# EAGLE design geiger (EAGLE 7.1.0)
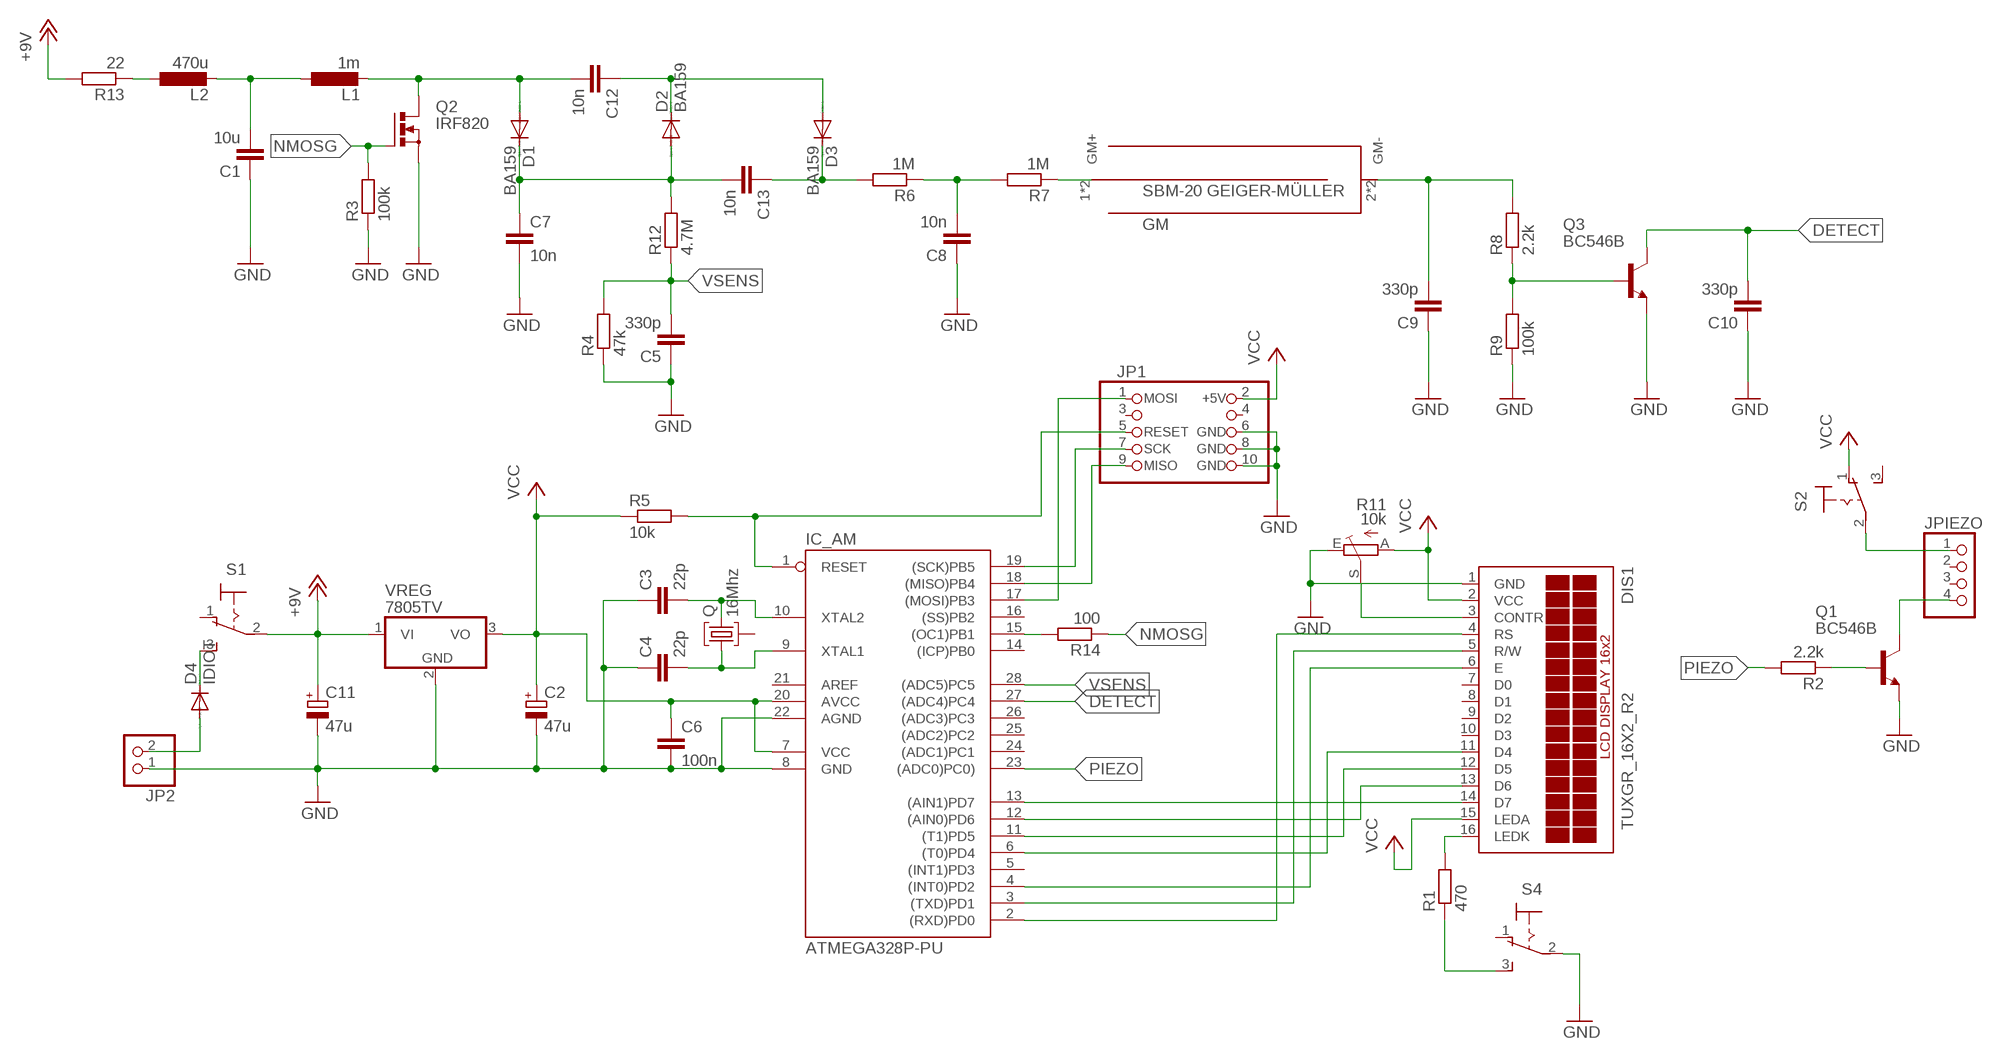
[diagram p0: schematic, sheet 1]

## Parts
C1  10u  C-EUC1206  [C1206]
C2  47u  CPOL-EUE2.5-6  [E2,5-6]
C3  22p  C-EUC0805  [C0805]
C4  22p  C-EUC0805  [C0805]
C5  330p  C-EU025-025X050  [C025-025X050]
C6  100n  C-EUC0805  [C0805]
C7  10n  C-EU050-025X075  [C050-025X075]
C8  10n  C-EU050-025X075  [C050-025X075]
C9  330p  C-EU025-025X050  [C025-025X050]
C10  330p  C-EU025-025X050  [C025-025X050]
C11  47u  CPOL-EUE2.5-6  [E2,5-6]
C12  10n  C-EU050-025X075  [C050-025X075]
C13  10n  C-EU050-025X075  [C050-025X075]
D1  BA159  DIODE-DO41-7.6  [DO41-7.6]
D2  BA159  DIODE-DO41-7.6  [DO41-7.6]
D3  BA159  DIODE-DO41-7.6  [DO41-7.6]
D4  IDIOT  DIODE-DO41-7.6  [DO41-7.6]
DIS1  TUXGR_16X2_R2  [TUXGR_16X2_R2]
GM  SBM-20  [SBM-20]
IC_AM  ATMEGA328P-PU  [DIL28-3]
JP1  ISP10-M  [2X05]
JP2  PINHD-1X2  [1X02]
JPIEZO  PINHD-1X4  [1X04]
L1  1m  L-EU6000-XXX-RC  [6000-XXXX-RC]
L2  470u  L-EU2200-12.7  [2200-12.7]
Q  16Mhz  10M15AHC49T  [HC49U]
Q1  BC546B  [TO92-EBC]
Q2  IRF820  IRF512  [TO220BV]
Q3  BC546B  [TO92-EBC]
R1  470  R-EU_0204/7  [0204/7]
R2  2.2k  R-EU_0204/7  [0204/7]
R3  100k  R-EU_0204/7  [0204/7]
R4  47k  R-EU_0204/7  [0204/7]
R5  10k  R-EU_0204/7  [0204/7]
R6  1M  R-EU_0204/7  [0204/7]
R7  1M  R-EU_0204/7  [0204/7]
R8  2.2k  R-EU_0204/7  [0204/7]
R9  100k  R-EU_0204/7  [0204/7]
R11  10k  TRIM_EU-CA6V  [CA6V]
R12  4.7M  R-EU_0204/7  [0204/7]
R13  22  R-EU_0204/7  [0204/7]
R14  100  R-EU_R0805  [R0805]
S1  320-916  [320-916]
S2  320-916  [320-916]
S4  320-916  [320-916]
VREG  7805TV  [TO220V]

## Nets
+9V: C11.+ R13.2 S1.2(P) VREG.1(VI)
DETECT: C10.2 IC_AM.27((ADC4)PC4) Q3.C
GND: C1.1 C2.- C3.1 C4.1 C5.1 C6.2 C7.2 C8.1 C9.1 C10.1 C11.- DIS1.1(GND) IC_AM.8(GND) IC_AM.22(AGND) JP1.6 JP1.8 JP1.10 JP2.1 Q1.E Q2.S Q3.E R3.1 R4.1 R9.1 R11.E S4.2(P) VREG.2(GND)
MISO: IC_AM.18((MISO)PB4) JP1.9
MOSI: IC_AM.17((MOSI)PB3) JP1.1
N$1: DIS1.14(D7) IC_AM.13((AIN1)PD7)
N$2: DIS1.13(D6) IC_AM.12((AIN0)PD6)
N$3: DIS1.12(D5) IC_AM.11((T1)PD5)
N$4: DIS1.11(D4) IC_AM.6((T0)PD4)
N$5: DIS1.3(CONTR) R11.S
N$6: DIS1.6(E) IC_AM.4((INT0)PD2)
N$7: DIS1.5(R/W) IC_AM.3((TXD)PD1)
N$8: DIS1.4(RS) IC_AM.2((RXD)PD0)
N$9: C7.1 C13.2 D1.C D2.A R12.2
N$10: DIS1.16(LEDK) R1.2
N$11: JPIEZO.4 Q1.C
N$12: Q1.B R2.1
N$14: C8.2 R6.1 R7.2
N$15: C9.2 GM.2(GM-) GM.4(GM-) R8.2
N$16: GM.1(GM+) GM.3(GM+) R7.1
N$17: D4.A JP2.2
N$18: Q3.B R8.1 R9.2
N$19: JPIEZO.1 S2.2(P)
N$20: R1.1 S4.3(S)
N$21: C12.1 D2.C D3.A
N$23: C1.2 L1.1 L2.2
N$24: L2.1 R13.1
N$25: IC_AM.15((OC1)PB1) R14.2
N$27: C12.2 D1.A L1.2 Q2.D
N$28: C13.1 D3.C R6.2
N$29: D4.C S1.3(S)
NMOSG: Q2.G R3.2 R14.1
PIEZO: IC_AM.23((ADC0)PC0)) R2.2
RESET: IC_AM.1(RESET) JP1.5 R5.2
SCK: IC_AM.19((SCK)PB5) JP1.7
VCC: C2.+ C6.1 DIS1.2(VCC) DIS1.15(LEDA) IC_AM.7(VCC) IC_AM.20(AVCC) JP1.2 R5.1 R11.A S2.1(O) VREG.3(VO)
VSENS: C5.2 IC_AM.28((ADC5)PC5) R4.2 R12.1
XTAL1: C4.2 IC_AM.9(XTAL1) Q.1
XTAL2: C3.2 IC_AM.10(XTAL2) Q.3
Unconnected: DIS1.7(D0) DIS1.8(D1) DIS1.9(D2) DIS1.10(D3) IC_AM.5((INT1)PD3) IC_AM.14((ICP)PB0) IC_AM.16((SS)PB2) IC_AM.21(AREF) IC_AM.24((ADC1)PC1) IC_AM.25((ADC2)PC2) IC_AM.26((ADC3)PC3) JP1.3 JP1.4 JPIEZO.2 JPIEZO.3 Q.2 S1.1(O) S2.3(S) S4.1(O)

## Library data of the parts
C1 C3-C10 C12 C13 = rcl:C-EU: CAPACITOR, European symbol
C2 C11 = rcl:CPOL-EU: POLARIZED CAPACITOR, European symbol
D1-D4 = diode:DIODE-: DIODE
DIS1 = display-lcd:TUXGR_16X2_R2: Tuxgraphics LCD display 16x2 characters reflective, without background light Source: tuxgr_12x2_r2.pdf; OC_FARNELL: unknown; OC_NEWARK: unknown
GM = own-lib:SBM-20: Russian SBM-20 Geiger Müller Tube
IC_AM = arduino_Uno_Rev3-02-TH:ATMEGA328P-: MICROCONTROLLER 4 Kbytes FLASH 128 bytes SRAM 256 bytes EEPROM UART 6-channel 10 bit ADC
JP1 = own-lib:ISP10-M: PIN HEADER
JP2 = pinhead:PINHD-1X2: PIN HEADER
JPIEZO = pinhead:PINHD-1X4: PIN HEADER
L1 L2 = rcl:L-EU: INDUCTOR, European symbol
Q = crystal:10M*A: Monolithic Crystal Filters Source: www.vanlong.com; OC_FARNELL: unknown; OC_NEWARK: unknown
Q1 Q3 = transistor-npn:BC546*: NPN Transistor
Q2 = transistor-power:IRF512: N-CHANNEL MOS FET
R1-R9 R12-R14 = rcl:R-EU_: RESISTOR, European symbol
R11 = pot:TRIM_EU-: POTENTIOMETER
S1 S2 S4 = switch:320-916: TOGGLE SWITCH distributor RS Components
VREG = linear:78*: Positive VOLTAGE REGULATOR Source: http://cache.national.com/ds/LM/LM78L05.pdf http://www.fairchildsemi.com/ds/LM/LM7805.pdf

## Board
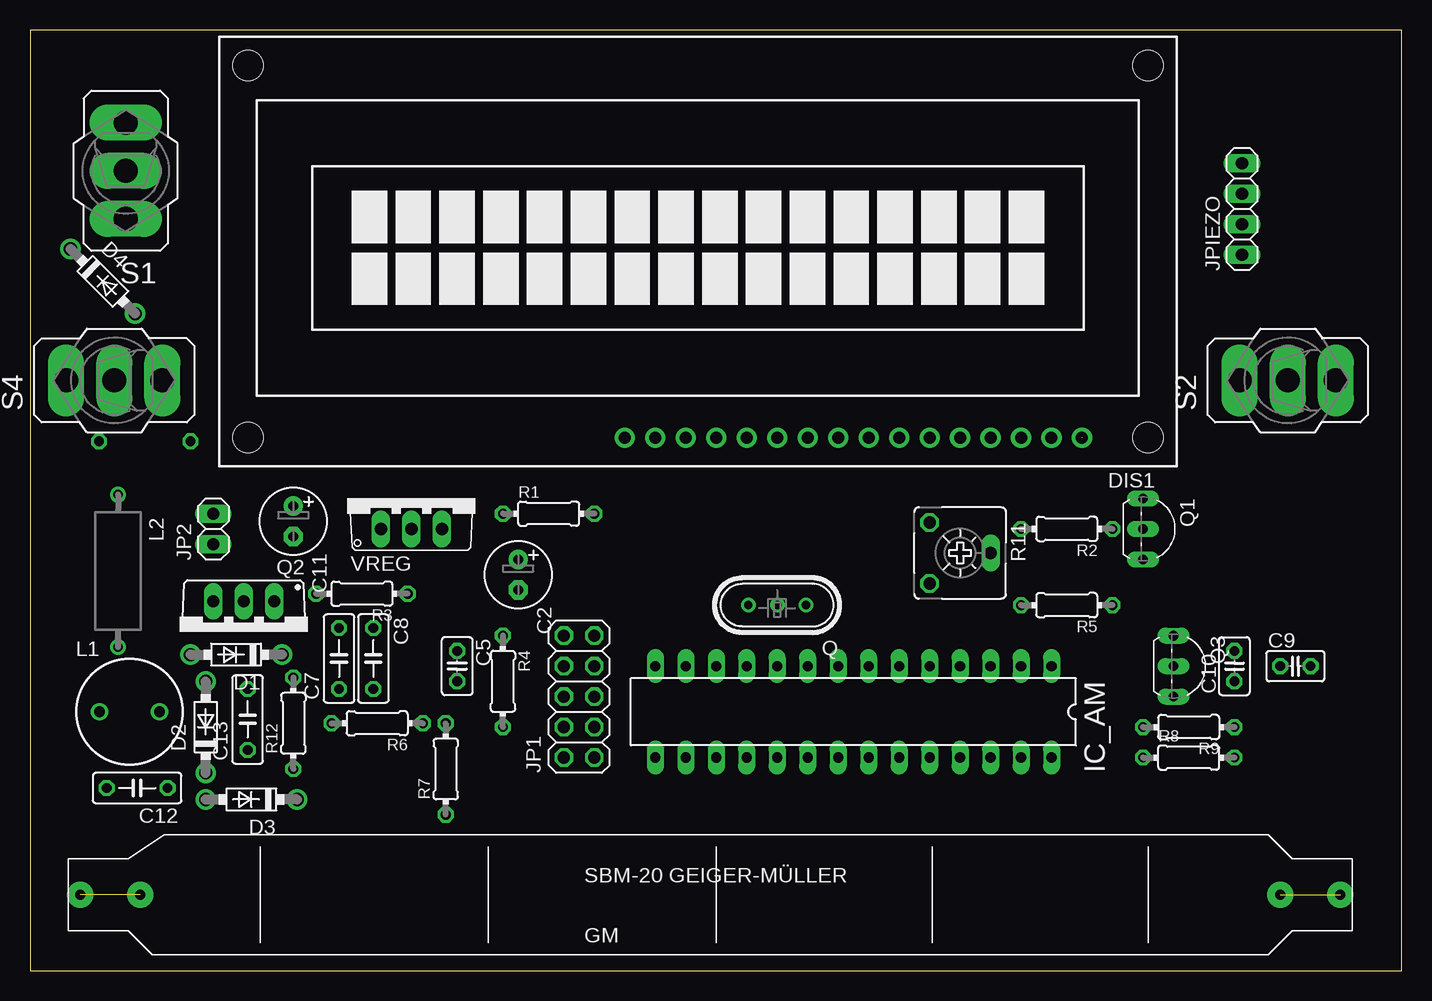
[diagram p1: board, top side]
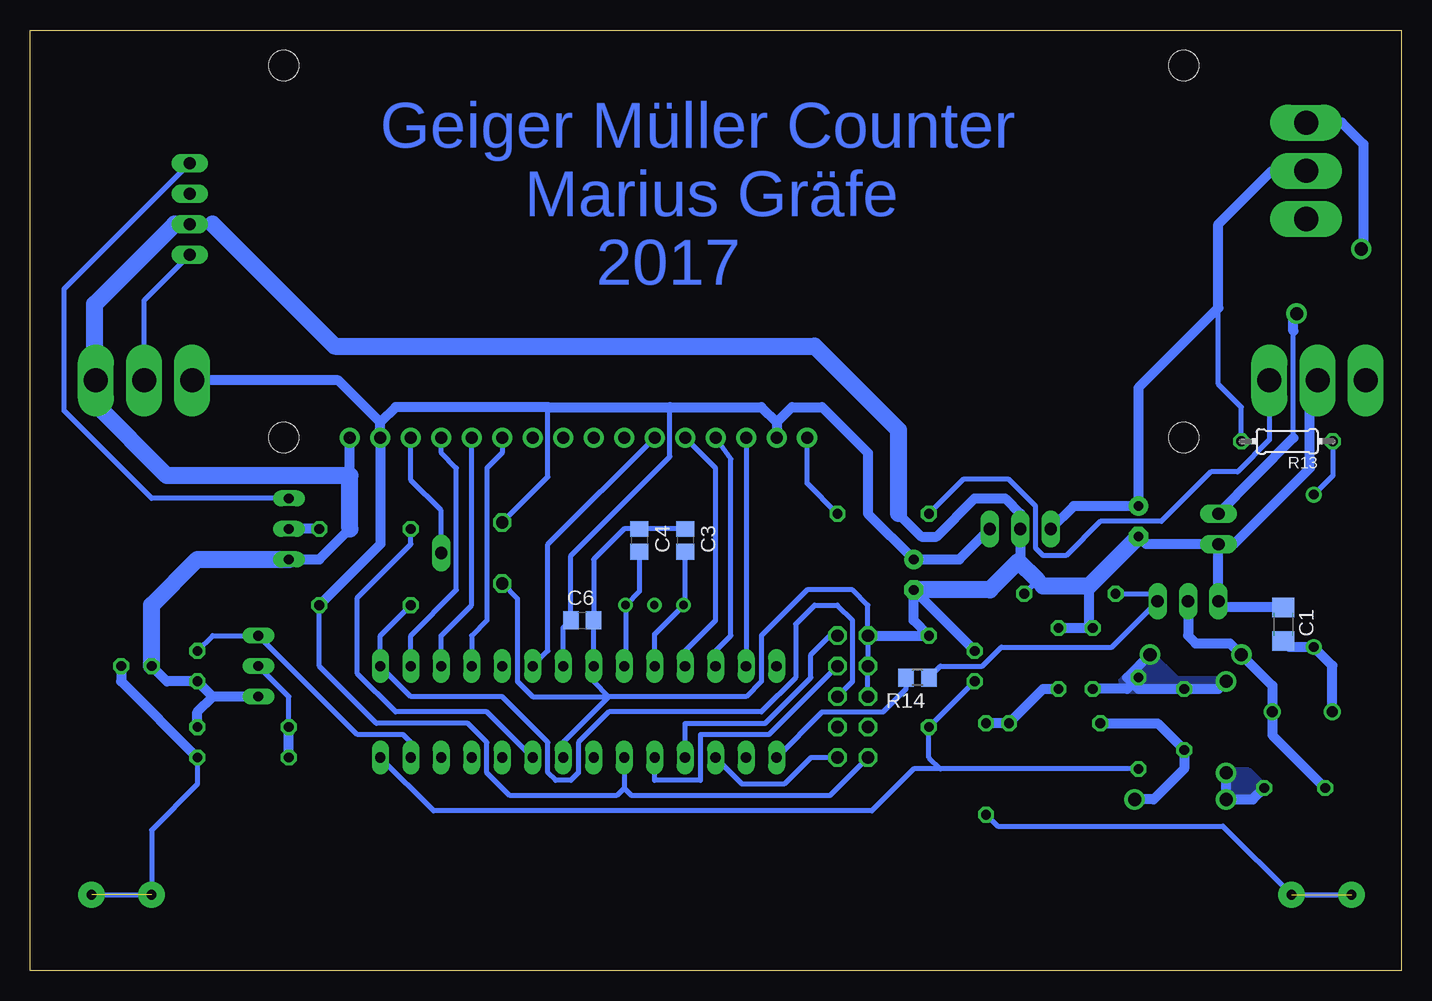
[diagram p2: board, bottom side, seen from below]

Size 114.28 x 78.41 mm. Coordinates in mm from the lower left corner, seen from the top.
Outline: 0,0 114.28,0 114.28,78.41 0,78.41 0,0
Copper layers (1*16): Top 0.035mm / dielectric 1.5mm / Bottom 0.035mm
Design rules "default": minimum track width 10mil, minimum drill 24mil, track to track 8mil, track to pad 8mil, pad to pad 8mil, via to via 8mil, smd to smd 8mil, copper to edge 40mil, drill to drill 8mil, minimum pad ring 10mil, minimum via ring 8mil, stop-mask expansion 4mil, vias tented up to drill 0mil, thermal gap 10mil

### Footprints (pad centres in the part's own frame; a part is rotated, then mirrored left to right if it is on the bottom)
C1206 = smd 1.6 x 1.8: 1 -1.4,0; 2 1.4,0
E2,5-6 = drill 0.813 pad 1.6: + -1.27,0 | drill 0.813 pad 1.6 octagon: - 1.27,0
C0805 = smd 1.3 x 1.5: 1 -0.95,0; 2 0.95,0
C025-025X050 = drill 0.813 octagon: 1 -1.27,0; 2 1.27,0
C050-025X075 = drill 0.813 octagon: 1 -2.54,0; 2 2.54,0
DO41-7.6 = drill 1.1 pad 1.7: A 3.81,0; C -3.81,0
TUXGR_16X2_R2 = drill 1 pad 1.676: 1 -31.746,15.246; 2 -29.206,15.246; 3 -26.666,15.246; 4 -24.126,15.246; 5 -21.586,15.246; 6 -19.046,15.246; 7 -16.506,15.246; 8 -13.966,15.246; 9 -11.426,15.246; 10 -8.886,15.246; 11 -6.346,15.246; 12 -3.806,15.246; 13 -1.266,15.246; 14 1.274,15.246; 15 3.814,15.246; 16 6.354,15.246 | hole 2.5: -37.246,-15.754; 37.754,-15.754; -37.246,15.246; 37.754,15.246
SBM-20 = drill 0.8 pad 2.184: 1 -48,0; 2 47,0; 3 -53,0; 4 52,0
DIL28-3 = drill 0.85 pad 1.422 long: 1 -16.51,-3.81; 2 -13.97,-3.81; 3 -11.43,-3.81; 4 -8.89,-3.81; 5 -6.35,-3.81; 6 -3.81,-3.81; 7 -1.27,-3.81; 8 1.27,-3.81; 9 3.81,-3.81; 10 6.35,-3.81; 11 8.89,-3.81; 12 11.43,-3.81; 13 13.97,-3.81; 14 16.51,-3.81; 15 16.51,3.81; 16 13.97,3.81; 17 11.43,3.81; 18 8.89,3.81; 19 6.35,3.81; 20 3.81,3.81; 21 1.27,3.81; 22 -1.27,3.81; 23 -3.81,3.81; 24 -6.35,3.81; 25 -8.89,3.81; 26 -11.43,3.81; 27 -13.97,3.81; 28 -16.51,3.81
2X05 = drill 1.016 octagon: 1 -5.08,-1.27; 2 -5.08,1.27; 3 -2.54,-1.27; 4 -2.54,1.27; 5 0,-1.27; 6 0,1.27; 7 2.54,-1.27; 8 2.54,1.27; 9 5.08,-1.27; 10 5.08,1.27
1X02 = drill 1.016 long: 1 -1.27,0; 2 1.27,0
1X04 = drill 1.016 long: 1 -3.81,0; 2 -1.27,0; 3 1.27,0; 4 3.81,0
6000-XXXX-RC = drill 0.9 pad 1.422: 1 -2.5,0; 2 2.5,0
2200-12.7 = drill 0.8 pad 1.27: 1 -6.35,0; 2 6.35,0
HC49U = drill 0.7 pad 1.2: 1 -2.413,0; 2 -0.027,0; 3 2.413,0
TO92-EBC = drill 0.813 long: B 0,-1.27; C -2.54,-1.27; E 2.54,-1.27
TO220BV = drill 1.016 long: D 0,-2.54; G -2.54,-2.54; S 2.54,-2.54
0204/7 = drill 0.813 octagon: 1 -3.81,0; 2 3.81,0
CA6V = drill 1.016 octagon: A -2.54,-2.54; E 2.54,-2.54 | drill 1.016 long: S 0,2.54
R0805 = smd 1.3 x 1.5: 1 -0.95,0; 2 0.95,0
320-916 = drill 2.007 long: 1 0,4.013; 2 0,0; 3 0,-4.013
TO220V = drill 1.016 long: 1 -2.54,-2.54; 2 0,-2.54; 3 2.54,-2.54

### Placement (x,y rotation side)
C1  9.84,28.89 270 bottom
C2  40.64,33.02 270 top
C3  59.69,35.88 270 bottom
C4  63.5,35.88 270 bottom
C5  35.56,25.4 270 top
C6  68.26,29.21 0 bottom
C7  25.72,26.04 90 top
C8  28.57,26.04 270 top
C9  105.41,25.4 0 top
C10  100.33,25.4 90 top
C11  21.91,37.47 270 top
C12  8.89,15.24 180 top
C13  18.1,20.96 90 top
D1  17.14,26.35 180 top
D2  14.61,20.32 90 top
D3  18.41,14.29 180 top
D4  6.03,57.47 315 top
DIS1  55.88,59.69 180 top
GM  57.15,6.35 0 top
IC_AM  68.58,21.59 180 top
JP1  45.72,22.86 90 top
JP2  15.24,36.83 90 top
JPIEZO  100.97,63.5 90 top
L1  8.25,21.59 0 top
L2  7.3,33.34 270 top
Q  62.23,30.48 180 top
Q1  93.98,36.83 270 top
Q2  17.78,28.26 180 top
Q3  96.52,25.4 270 top
R1  43.18,38.1 0 top
R2  86.36,36.83 180 top
R3  27.62,31.43 180 top
R4  39.37,24.13 270 top
R5  86.36,30.48 180 top
R6  28.89,20.64 180 top
R7  34.61,16.83 90 top
R8  96.52,17.78 0 top
R9  96.52,20.32 180 top
R11  77.47,34.83 270 top
R12  21.91,20.64 90 top
R13  9.52,44.13 180 bottom
R14  40.32,24.45 180 bottom
S1  7.94,66.68 180 top
S2  104.78,49.21 90 top
S4  6.98,49.21 90 top
VREG  31.75,39.37 0 top

### Tracks (layer width: path | path; a pad name or v marks a point on that pad's centre or on a via)
+9V
  Bottom 0.406: R13.2 13.34,46.99 15.24,48.9 15.24,55.25
  Bottom 0.813: C11.+ 21.91,39.05 | S1.2 10.8,66.68 15.24,62.23 15.24,55.25 21.91,48.58 C11.+ | C11.+ 27.3,38.74 VREG.1
DETECT
  Bottom 0.406: IC_AM.27 82.55,19.05 83.19,19.69 87,19.69 Q3.C 99.06,27.94 C10.2
GND  (1 unrouted)
  Bottom 0.406: JP1.6 JP1.8 JP1.10 44.45,30.48 45.72,31.75 49.53,31.75 53.34,27.94 53.34,24.13 54.61,22.86 66.04,22.86 | 66.04,22.86 67.31,24.13 IC_AM.8 67.31,28.89 arc-90 C6.2 67.31,34.29 64.77,36.83 C4.1 C3.1 | 66.04,22.86 69.85,19.05 IC_AM.22 | R11.E 73.66,31.02 73.66,24.13 72.39,22.86 66.04,22.86 | R3.1 30.32,32.54
  Bottom 0.813: 31.91,34.13 31.75,34.29 VREG.2 31.75,38.1 33.02,39.37 35.56,39.37 38.73,36.2 40.01,36.2 41.91,38.1 | C5.1 C2.- 40.64,29.21 R4.1 JP1.10 | Q3.E 99.06,22.86 | 99.06,22.86 C10.1 102.87,24.13 C9.1 | Q1.E 90.17,34.29 87.63,36.83 | 87.63,41.28 DIS1.1 | JP2.1 13.97,35.56 7.62,41.91 7.62,47.94 6.98,48.26 S4.2 | JP2.1 21.27,35.56 C11.- | 102.23,62.23 99.06,62.23 | R9.1 100.33,21.59 99.06,22.86 | JP2.1 Q2.S 14.73,30.29 C1.1 | 29.84,32.07 30.32,32.54 | 26.04,32.07 26.04,28.89 C7.2 C8.1
  Bottom 1.422: C2.- 34.29,31.75 31.91,34.13 30.32,32.54 | 87.63,36.83 87.63,41.28 102.87,41.28 108.9,47.31 108.9,55.56 102.23,62.23 | 41.91,38.1 41.91,45.09 48.89,52.07 88.9,52.07 99.06,62.23 | C9.1 104.14,30.48 100.33,34.29 Q1.E | 29.84,32.07 26.04,32.07 C11.-
MISO
  Bottom 0.406: IC_AM.18 59.69,20.64 53.02,20.64 49.21,24.45 49.21,26.35 47.62,27.94 JP1.9
MOSI
  Bottom 0.406: JP1.1 49.21,17.78 51.44,15.56 54.93,15.56 IC_AM.17
N$1
  Bottom 0.406: DIS1.14 54.61,44.19 IC_AM.13
N$2
  Bottom 0.406: 57.15,43.94 DIS1.13 55.88,42.67 55.88,27.94 57.15,26.67 IC_AM.12
N$3
  Bottom 0.406: IC_AM.11 59.69,26.67 57.15,29.21 57.15,41.91 DIS1.12
N$4
  Bottom 0.406: IC_AM.6 71.12,26.67 71.12,35.55 DIS1.11
N$5
  Bottom 0.406: R11.S 80.01,38.37 82.55,40.91 DIS1.3
N$6
  Bottom 0.406: DIS1.6 74.93,43.18 76.2,41.9 76.2,29.21 77.47,27.94 IC_AM.4
N$7
  Bottom 0.406: IC_AM.3 80.01,27.94 77.47,30.48 77.47,43.18 DIS1.5
N$8
  Bottom 0.406: IC_AM.2 82.55,27.94 78.74,31.75 78.74,41.91 80.01,43.18 DIS1.4
N$9
  Bottom 0.813: D1.C 22.86,24.45 | 22.86,24.45 R12.2 22.86,23.5 C7.1 | 22.86,24.45 21.91,23.5 C13.2 15.24,23.5 D2.A
  pour Bottom (no thermals): 14.61,24.13 18.73,24.13 20.95,26.35 23.18,24.13 23.18,23.81 22.86,23.5 16.19,23.5 15.24,23.5
N$10
  Bottom 0.406: R1.2 49.53,40.64 DIS1.16
N$11
  Bottom 0.406: Q1.C 104.14,39.37 111.44,46.67 111.44,56.83 JPIEZO.4
N$12
  Bottom 0.813: R2.1 Q1.B
N$13
  Bottom 0.406: 9.21,6.35 4.13,6.35
N$14
  Bottom 0.813: C8.2 29.84,23.5 R6.1 R7.2
N$15  (1 unrouted)
  Bottom 0.406: R8.2 100.33,15.56 104.15,11.74 GM.2
  Bottom 0.813: C9.2 106.68,24.13 R8.2
N$16  (1 unrouted)
  Bottom 0.406: R7.1 33.66,12.07 14.86,12.07 GM.1
N$17
  Bottom 0.406: 8.99,44.43 8.99,53.32
  Bottom 0.813: JP2.2 8.99,44.43 | 8.99,53.32 8.99,54.77 D4.A
N$18
  Bottom 0.406: Q3.B 92.71,22.86 R9.2
  Bottom 0.813: R8.1 R9.2
N$19
  Bottom 0.406: JPIEZO.1 104.78,55.88 S2.2
N$20
  Bottom 0.406: S4.3 11,44.25 13.65,41.59 15.88,41.59 20,37.47 25.08,37.47 27.94,34.61 29.84,34.61 30.48,35.24 30.48,38.74 32.7,40.96 36.51,40.96 R1.1
N$21
  Bottom 0.813: D2.C D3.A 12.38,14.29 C12.1
  pour Bottom (no thermals): 11.43,15.24 12.7,16.51 14.61,16.51 14.61,14.29 12.38,14.29
N$23
  Bottom 0.813: L1.1 5.75,25.44 L2.2 9.34,26.99 C1.2
N$24
  Bottom 0.406: R13.1 5.71,41.28 L2.1
N$25
  Bottom 0.406: IC_AM.15 48.26,21.59 43.18,21.59 41.27,23.5 R14.2
N$26
  Bottom 0.406: 109.22,6.35 104.14,6.35
N$27
  Bottom 0.813: C12.2 10.75,19.65 L1.2 10.75,23.77 D1.A 14.29,27.31 17.14,27.31 17.78,27.94 Q2.D
N$28
  Bottom 0.813: R6.2 20.32,20.64 C13.1 18.1,16.83 20.64,14.29 D3.C
N$29
  Bottom 0.813: S1.3 4.97,70.69 3.18,68.9 3.18,60.33 D4.C
NMOSG
  Bottom 0.406: R14.1 38.42,25.4 34.92,25.4 33.34,26.99 24.13,26.99 Q2.G 20.95,31.43 R3.2
PIEZO
  Bottom 0.406: IC_AM.23 76.2,21.59 83.82,21.59 87,24.77 87,31.12 82.55,35.56 R2.2
RESET
  Bottom 0.406: JP1.5 45.72,24.13 45.72,29.21 46.99,30.48 48.89,30.48 50.48,28.89 50.48,24.45 53.34,21.59 66.04,21.59 68.58,19.05 68.58,16.51 69.22,15.88 70.48,15.88 71.12,16.51 71.12,19.05 74.93,22.86 82.55,22.86 IC_AM.1 85.09,27.94 R5.2
SCK
  Bottom 0.406: JP1.7 52.7,19.69 58.42,19.69 58.42,15.88 62.23,15.88 IC_AM.19
VCC
  Bottom 0.406: JP1.2 47.62,14.61 64.13,14.61 64.77,15.24 | R5.1 90.17,25.4 85.41,20.64 77.79,20.64 76.2,19.05 76.2,16.51 74.3,14.61 65.41,14.61 64.77,15.24 | 60.96,46.99 60.96,42.86 69.21,34.61 C6.1 69.85,28.58 IC_AM.7 | IC_AM.20 64.77,15.24 | R11.A 71.12,41.18 71.12,46.99
  Bottom 0.813: VREG.3 36.83,34.29 C2.+ 44.45,38.1 44.45,43.18 48.26,46.99 50.8,46.99 52.07,45.72 | 52.07,45.72 DIS1.15 | 52.07,45.72 53.33,46.99 60.96,46.99 71.12,46.99 83.82,46.99 85.09,45.72 | R5.1 85.09,35.56 DIS1.2 85.09,45.72 | 85.09,45.72 88.58,49.21 S2.1
VSENS
  Bottom 0.406: IC_AM.28 80.65,13.34 44.13,13.34 40.64,16.83 38.42,16.83 | C5.2 R4.2 39.37,17.78 38.42,16.83 | R12.1 38.42,16.83
XTAL1
  Bottom 0.406: IC_AM.9 64.64,25.53 Q.1 63.5,31.62 C4.2
XTAL2
  Bottom 0.406: IC_AM.10 62.23,28.07 Q.3 59.69,30.61 C3.2

### Text on the board
Bottom: Geiger Müller Counter / Marius Gräfe / 2017